# EAGLE design state_control (EAGLE 7.7.0)
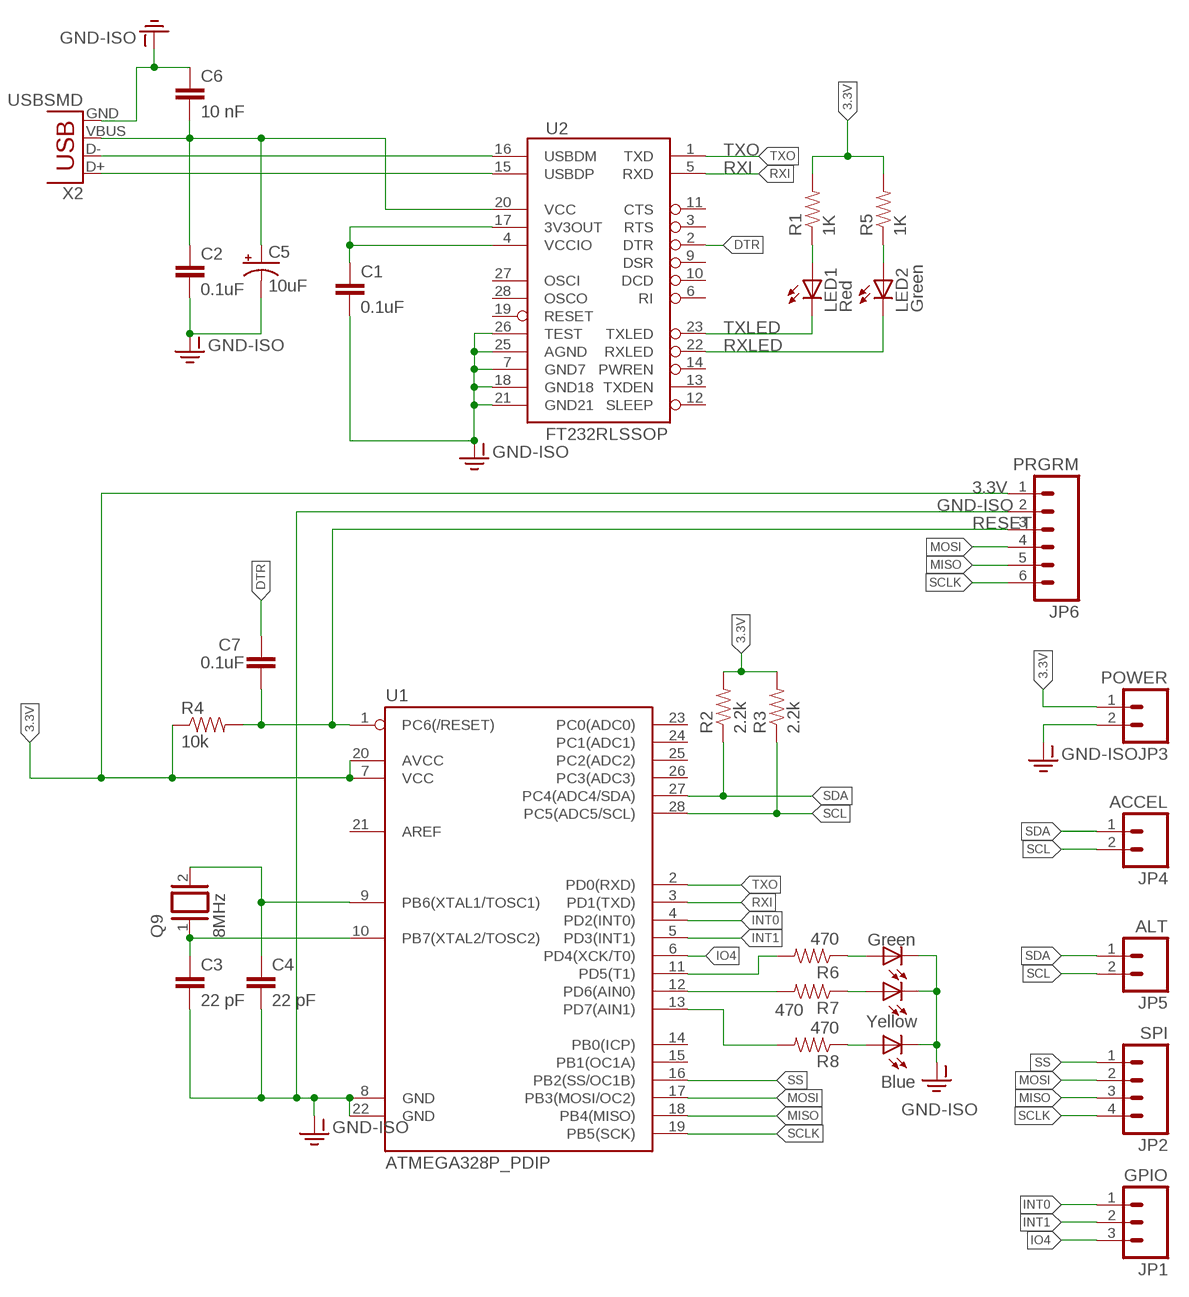
[diagram p0: schematic, sheet 1]

## Parts
C1  0.1uF  CAPPTH  [CAP-PTH-SMALL]
C2  0.1uF  CAPPTH  [CAP-PTH-SMALL]
C3  22 pF  CAPPTH  [CAP-PTH-SMALL]
C4  22 pF  CAPPTH  [CAP-PTH-SMALL]
C5  10uF  CAP_POLPTH2  [CPOL-RADIAL-10UF-25V]
C6  10 nF  CAPPTH  [CAP-PTH-SMALL]
C7  0.1uF  CAPPTH  [CAP-PTH-SMALL]
JP1  GPIO  M03PTH  [1X03]
JP2  SPI  M04PTH  [1X04]
JP3  POWER  M02PTH  [1X02]
JP4  ACCEL  M02PTH  [1X02]
JP5  ALT  M02PTH  [1X02]
JP6  PRGRM  M06SILK_FEMALE_PTH  [1X06]
LED1  Red  LED5MM  [LED5MM]
LED2  Green  LED5MM  [LED5MM]
LED3  Green  LED5MM  [LED5MM]
LED4  Yellow  LED5MM  [LED5MM]
LED5  Blue  LED5MM  [LED5MM]
Q9  8MHz  XTAL/S  [QS]
R1  1K  RESISTOR1206  [1206]
R2  2.2k  RESISTOR1206  [1206]
R3  2.2k  RESISTOR1206  [1206]
R4  10k  RESISTOR1206  [1206]
R5  1K  RESISTOR1206  [1206]
R6  470  RESISTOR1206  [1206]
R7  470  RESISTOR1206  [1206]
R8  470  RESISTOR1206  [1206]
U1  ATMEGA328P_PDIP  [DIL28-3]
U2  FT232RLSSOP  [SSOP28DB]
X2  USBSMD  [USB-MINIB]

## Nets
3.3V: JP3.1 JP6.1 R1.2 R2.2 R3.2 R4.1 R5.2 U1.7(VCC) U1.20(AVCC)
DTR: C7.1 U2.2(DTR)
GND-ISO: C1.2 C2.2 C3.2 C4.2 C5.2(-) C6.1 JP3.2 JP6.2 LED3.K(C) LED4.K(C) LED5.K(C) U1.8(GND) U1.22(GND) U2.7(GND7) U2.18(GND18) U2.21(GND21) U2.25(AGND) U2.26(TEST) X2.GND
INT0: JP1.1 U1.4(PD2(INT0))
INT1: JP1.2 U1.5(PD3(INT1))
IO4: JP1.3 U1.6(PD4(XCK/T0))
MISO: JP2.3 JP6.5 U1.18(PB4(MISO))
MOSI: JP2.2 JP6.4 U1.17(PB3(MOSI/OC2))
N$1: LED1.A R1.1
N$2: LED2.A R5.1
N$4: C1.1 U2.4(VCCIO) U2.17(3V3OUT)
N$5: R6.2 U1.11(PD5(T1))
N$6: R7.2 U1.12(PD6(AIN0))
N$7: R8.2 U1.13(PD7(AIN1))
N$8: LED3.A R6.1
N$9: LED4.A R7.1
N$10: LED5.A R8.1
N$11: C3.1 Q9.1 U1.10(PB7(XTAL2/TOSC2))
N$20: C4.1 Q9.2 U1.9(PB6(XTAL1/TOSC1))
RESET: C7.2 JP6.3 R4.2 U1.1(PC6(/RESET))
RXI: U1.3(PD1(TXD)) U2.5(RXD)
RXLED: LED2.K(C) U2.22(RXLED)
SCL: JP4.2 JP5.2 R3.1 U1.28(PC5(ADC5/SCL))
SCLK: JP2.4 JP6.6 U1.19(PB5(SCK))
SDA: JP4.1 JP5.1 R2.1 U1.27(PC4(ADC4/SDA))
SS: JP2.1 U1.16(PB2(SS/OC1B))
TXLED: LED1.K(C) U2.23(TXLED)
TXO: U1.2(PD0(RXD)) U2.1(TXD)
USB_D+: U2.15(USBDP) X2.D+
USB_D-: U2.16(USBDM) X2.D-
VBUS: C2.1 C5.1(+) C6.2 U2.20(VCC) X2.VBUS
Unconnected: U1.14(PB0(ICP)) U1.15(PB1(OC1A)) U1.21(AREF) U1.23(PC0(ADC0)) U1.24(PC1(ADC1)) U1.25(PC2(ADC2)) U1.26(PC3(ADC3)) U2.3(RTS) U2.6(RI) U2.9(DSR) U2.10(DCD) U2.11(CTS) U2.12(SLEEP) U2.13(TXDEN) U2.14(PWREN) U2.19(RESET) U2.27(OSCI) U2.28(OSCO)

## Library data of the parts
C1-C4 C6 C7 = SparkFun-Capacitors:CAP: Capacitor Standard 0603 ceramic capacitor, and 0.1" leaded capacitor.
C5 = SparkFun-Passives:CAP_POL: Capacitor Polarized These are standard SMD and PTH capacitors. Normally 10uF, 47uF, and 100uF in electrolytic and tantalum varieties. Always verify the external diameter of the through hole cap, it varies with capacity, voltage, and manufacturer. The EIA devices should be standard.
JP1 = SparkFun-Connectors:M03: Header 3 Standard 3-pin 0.1" header. Use with straight break away headers (SKU : PRT-00116), right angle break away headers (PRT-00553), swiss pins (PRT-00743), machine pins (PRT-00117), and female headers (PRT-00115). Molex polarized connector foot print use with SKU : PRT-08232 with associated crimp pins and housings.
JP2 = SparkFun-Connectors:M04: Header 4 Standard 4-pin 0.1" header. Use with straight break away headers (SKU : PRT-00116), right angle break away headers (PRT-00553), swiss pins (PRT-00743), machine pins (PRT-00117), and female headers (PRT-00115). Molex polarized connector foot print use with SKU : PRT-08231 with associated crimp pins and housings. 1MM SMD Version SKU: PRT-10208
JP3-JP5 = SparkFun-Connectors:M02: Standard 2-pin 0.1" header. Use with - straight break away headers ( PRT-00116) - right angle break away headers (PRT-00553) - swiss pins (PRT-00743) - machine pins (PRT-00117) - female headers (PRT-00115) Molex polarized connector foot print use with: PRT-08233 with associated crimp pins and housings. 2.54_SCREWTERM for use with PRT-10571. 3.5mm Screw Terminal footprints for PRT-08084 5mm Screw Terminal footprints for use with PRT-08432
JP6 = SparkFun-Connectors:M06: Header 6 Standard 6-pin 0.1" header. Use with straight break away headers (SKU : PRT-00116), right angle break away headers (PRT-00553), swiss pins (PRT-00743), machine pins (PRT-00117), and female headers (PRT-00115). Molex polarized connector foot print use with SKU : PRT-08094 with associated crimp pins and housings. NOTES ON THE VARIANTS LOCK and LOCK_LONGPADS... This footprint was designed to help hold the alignment of a through-hole component (i.e. 6-pin header) while soldering it into place. You may notice that each hole has been shifted either up or down by 0.005 of an inch from it's more standard position (which is a perfectly straight line). This slight alteration caused the pins (the squares in the middle) to touch the edges of the holes. Because they are alternating, it causes a "brace" to hold the component in place. 0.005 has proven to be the perfect amount of "off-center" position when using our standard breakaway headers. Although looks a little odd when you look at the bare footprint, once you have a header in there, the alteration is very hard to notice. Also,if you push a header all the way into place, it is covered up entirely on the bottom side. This idea of altering the position of holes to aid alignment will be further integrated into the Sparkfun Library for other footprints. It can help hold any component with 3 or more connection pins.; PROD_ID: CONN-08437
LED1-LED5 = adafruit:LED: LED OSRAM: - CHIPLED LG R971, LG N971, LY N971, LG Q971, LY Q971, LO R971, LY R971 LH N974, LH R974 LS Q976, LO Q976, LY Q976 LO Q996 - Hyper CHIPLED LW Q18S LB Q993, LB Q99A, LB R99A - SideLED LS A670, LO A670, LY A670, LG A670, LP A670 LB A673, LV A673, LT A673, LW A673 LH A674 LY A675 LS A676, LA A676, LO A676, LY A676, LW A676 LS A679, LY A679, LG A679 - Hyper Micro SIDELED® LS Y876, LA Y876, LO Y876, LY Y876 LT Y87S - SmartLED LW L88C, LW L88S LB L89C, LB L89S, LG L890 LS L89K, LO L89K, LY L89K LS L896, LA L896, LO L896, LY L896 - TOPLED LS T670, LO T670, LY T670, LG T670, LP T670 LSG T670, LSP T670, LSY T670, LOP T670, LYG T670 LG T671, LOG T671, LSG T671 LB T673, LV T673, LT T673, LW T673 LH T674 LS T676, LA T676, LO T676, LY T676, LB T676, LH T676, LSB T676, LW T676 LB T67C, LV T67C, LT T67C, LS T67K, LO T67K, LY T67K, LW E67C LS E67B, LA E67B, LO E67B, LY E67B, LB E67C, LV E67C, LT E67C LW T67C LS T679, LY T679, LG T679 LS T770, LO T770, LY T770, LG T770, LP T770 LB T773, LV T773, LT T773, LW T773 LH T774 LS E675, LA E675, LY E675, LS T675 LS T776, LA T776, LO T776, LY T776, LB T776 LHGB T686 LT T68C, LB T68C - Hyper Mini TOPLED® LB M676 - Mini TOPLED Santana® LG M470 LS M47K, LO M47K, LY M47K Source: http://www.osram.convergy.de/
Q9 = special:XTAL/S: CRYSTAL
R1 R5 = SparkFun-Resistors:RESISTOR: Resistor Basic schematic elements and footprints for 0603, 1206, and PTH resistors.
R2-R4 R6-R8 = SparkFun-Passives:RESISTOR: Resistor Basic schematic elements and footprints for 0603, 1206, and PTH resistors.
U1 = SparkFun-DigitalIC:ATMEGA328P_PDIP: uC used in the Arduino 32kb flash, 1k EEPROM, 2k SRAM This is the through-hole version of this chip.
U2 = SparkFun:FT232RL: USB UART FT232RL 4th Generation USB UART (USB <-> Serial) Controller. Spark Fun Electronics SKU : COM-00650
X2 = SparkFun-Connectors:USB: USB Connectors USB-B-PTH is fully proven SKU : PRT-00139/CONN-08278 USB-miniB is fully proven SKU : PRT-00587 USB-A-PCB is untested. USB-A-H is throughly reviewed, but untested. Spark Fun Electronics SKU : PRT-00437 USB-B-SMT is throughly reviewed, but untested. Needs silkscreen touching up. USB-A-S has not been used/tested USB-MB-H has not been used/tested USB-MICROB has been used. CONN-09505; PROD_ID: CONN-08193

## Net classes
1 actuator: width 0.813 mm, clearance 0.229 mm

## Board
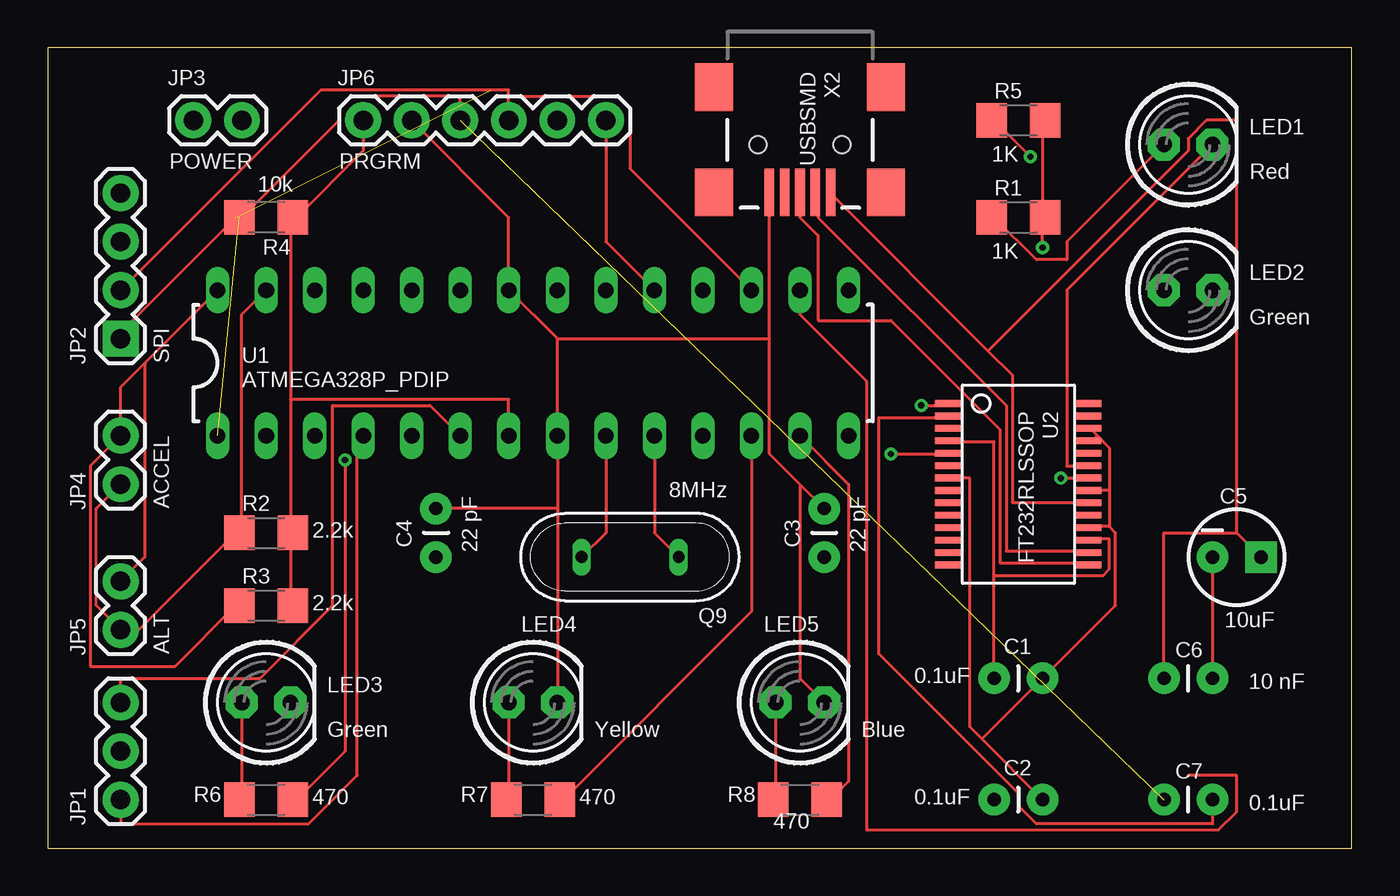
[diagram p1: board, top side]
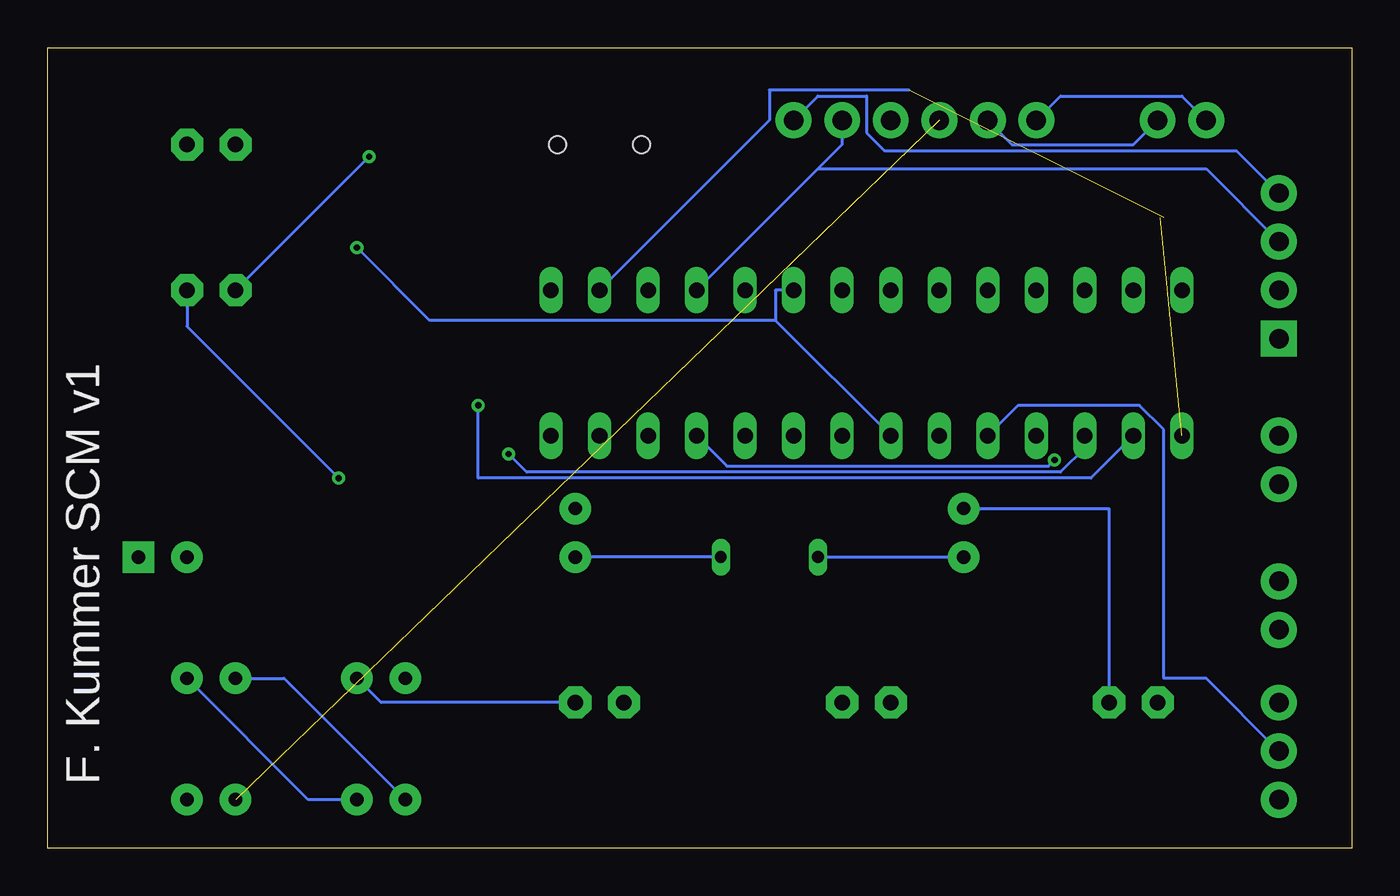
[diagram p2: board, bottom side, seen from below]

Size 68.25 x 41.9 mm. Coordinates in mm from the lower left corner, seen from the top.
Outline: 0,0 68.25,0 68.25,41.9 0,41.9 0,0
Copper layers (1*16): Top 0.0356mm / dielectric 1.5011mm / Bottom 0.0356mm
Design rules "LaenPCBOrder": minimum track width 6mil, minimum drill 13mil, track to track 6mil, track to pad 6mil, pad to pad 6mil, via to via 6mil, smd to smd 6mil, copper to edge 15mil, drill to drill 6mil, minimum pad ring 7mil, minimum via ring 7mil, stop-mask expansion 3mil, vias tented up to drill 0mil, thermal gap 10mil

### Footprints (pad centres in the part's own frame; a part is rotated, then mirrored left to right if it is on the bottom)
CAP-PTH-SMALL = drill 0.7 pad 1.651: 1 0,0; 2 2.54,0
CPOL-RADIAL-10UF-25V = drill 0.7 pad 1.651 square: 1 1.27,0 | drill 0.7 pad 1.651: 2 -1.27,0
1X03 = drill 1.016 pad 1.88: 1 0,0; 2 2.54,0; 3 5.08,0
1X04 = drill 1.016 pad 1.88 square: 1 0,0 | drill 1.016 pad 1.88: 2 2.54,0; 3 5.08,0; 4 7.62,0
1X02 = drill 1.016 pad 1.88: 1 0,0; 2 2.54,0
1X06 = drill 1.016 pad 1.88: 1 0,0; 2 2.54,0; 3 5.08,0; 4 7.62,0; 5 10.16,0; 6 12.7,0
LED5MM = drill 0.813 pad 1.676 octagon: A -1.27,0; K 1.27,0
QS = drill 0.61 long: 1 -2.54,0; 2 2.54,0
1206 = smd 1.6 x 1.8: 1 -1.4,0; 2 1.4,0
DIL28-3 = drill 0.813 long: 1 -16.51,-3.81; 2 -13.97,-3.81; 3 -11.43,-3.81; 4 -8.89,-3.81; 5 -6.35,-3.81; 6 -3.81,-3.81; 7 -1.27,-3.81; 8 1.27,-3.81; 9 3.81,-3.81; 10 6.35,-3.81; 11 8.89,-3.81; 12 11.43,-3.81; 13 13.97,-3.81; 14 16.51,-3.81; 15 16.51,3.81; 16 13.97,3.81; 17 11.43,3.81; 18 8.89,3.81; 19 6.35,3.81; 20 3.81,3.81; 21 1.27,3.81; 22 -1.27,3.81; 23 -3.81,3.81; 24 -6.35,3.81; 25 -8.89,3.81; 26 -11.43,3.81; 27 -13.97,3.81; 28 -16.51,3.81
SSOP28DB = smd 0.348 x 1.397: 1 -4.225,-3.656; 2 -3.575,-3.656; 3 -2.925,-3.656; 4 -2.275,-3.656; 5 -1.625,-3.656; 6 -0.975,-3.656; 7 -0.325,-3.656; 8 0.325,-3.656; 9 0.975,-3.656; 10 1.625,-3.656; 11 2.275,-3.656; 12 2.925,-3.656; 13 3.575,-3.656; 14 4.225,-3.656; 15 4.225,3.656; 16 3.575,3.656; 17 2.925,3.656; 18 2.275,3.656; 19 1.625,3.656; 20 0.975,3.656; 21 0.325,3.656; 22 -0.325,3.656; 23 -0.975,3.656; 24 -1.625,3.656; 25 -2.275,3.656; 26 -2.925,3.656; 27 -3.575,3.656; 28 -4.225,3.656
USB-MINIB = smd 2.5 x 0.5: D+ 2.5,0; D- 2.5,0.8; GND 2.5,-1.6; ID 2.5,-0.8; VBUS 2.5,1.6 | smd 2.5 x 2: MTN1 -3,4.5; MTN2 2.5,4.5; MTN3 -3,-4.5; MTN4 2.5,-4.5 | hole 0.9: 0,2.2; 0,-2.2

### Placement (x,y rotation side)
C1  49.53,8.89 0 top
C2  49.53,2.54 0 top
C3  40.64,15.24 90 top
C4  20.32,15.24 90 top
C5  62.23,15.24 0 top
C6  60.96,8.89 180 top
C7  60.96,2.54 180 top
JP1  3.81,2.54 90 top
JP2  3.81,26.67 90 top
JP3  7.62,38.1 0 top
JP4  3.81,19.05 90 top
JP5  3.81,11.43 90 top
JP6  16.51,38.1 0 top
LED1  59.69,36.83 0 top
LED2  59.69,29.21 0 top
LED3  11.43,7.62 0 top
LED4  25.4,7.62 0 top
LED5  39.37,7.62 0 top
Q9  30.48,15.24 180 top
R1  50.8,33.02 0 top
R2  11.43,16.51 0 top
R3  11.43,12.7 0 top
R4  11.43,33.02 180 top
R5  50.8,38.1 0 top
R6  11.43,2.54 0 top
R7  25.4,2.54 0 top
R8  39.37,2.54 0 top
U1  25.4,25.4 0 top
U2  50.8,19.05 270 top
X2  39.37,36.83 270 top

### Tracks (layer width: path | path; a pad name or v marks a point on that pad's centre or on a via)
3.3V  (via drill 0.33)
  Top 0.152: 12.7,16.51 12.7,12.7 R3.2 | JP6.1 16.51,36.51 13.02,33.02 R4.1 12.7,33.02 12.7,23.49 | 12.7,23.49 12.7,16.51 | 12.7,16.51 R2.2 | 52.07,33.02 52.07,38.1 R5.2 | v52.07,31.43 52.07,33.02 | 52.07,33.02 R1.2 | 12.7,23.49 24.13,23.49 U1.7
  Bottom 0.152: JP3.1 8.89,39.37 15.24,39.37 JP6.1 | 30.16,27.62 U1.7 | 30.16,27.62 30.16,29.21 U1.20 | v52.07,31.43 48.26,27.62 30.16,27.62
DTR
  Top 0.152: C7.1 60.96,1.27 51.75,1.27 50.8,2.22 50.8,2.86 43.5,10.16 43.5,22.54 46.99,22.54 U2.2
GND-ISO
  Top 0.152: 55.56,16.83 54.61,16.83 U2.18 | 55.56,18.73 55.56,20.95 54.93,21.59 | 55.56,18.73 55.56,16.83 | 54.93,21.59 54.61,21.91 U2.26 | 55.56,18.73 54.61,18.73 U2.21 | 54.93,21.59 54.61,21.27 U2.25 | 55.56,16.83 55.88,16.51 55.88,12.7 C1.2 48.9,5.71 | C5.2 C6.1 | C2.2 48.9,5.71 | 48.9,5.71 48.26,6.35 48.26,19.37 47.31,19.37 U2.7 | 37.78,26.67 37.78,20.64 39.37,19.05 | 37.78,26.67 37.78,34.29 X2.GND | C3.2 39.37,19.05 | LED5.K 39.37,8.89 39.37,19.05 | 26.67,26.67 U1.22 24.13,33.02 JP6.2 | 26.67,26.67 U1.8 26.67,17.78 | 26.67,17.78 C4.2 | 26.67,17.78 LED4.K | 26.67,26.67 37.78,26.67
  Bottom 0.152: C6.1 54.61,2.54 C2.2 | JP3.2 11.43,36.83 17.78,36.83 JP6.2 | LED3.K 12.7,17.78 C4.2 | C1.2 50.8,7.62 LED5.K
INT0
  Top 0.152: U1.4 16.19,21.27 16.19,3.81 13.65,1.27 3.81,1.27 JP1.1
INT1
  Bottom 0.152: U1.5 17.46,23.18 11.11,23.18 9.84,21.91 9.84,8.89 7.62,8.89 JP1.2
IO4
  Top 0.152: U1.6 20,23.18 14.92,23.18 14.92,12.7 11.11,8.89 3.81,8.89 JP1.3
MISO
  Bottom 0.152: 27.94,35.56 26.67,36.83 JP6.5 | 27.94,35.56 U1.18 | JP2.3 7.62,35.56 27.94,35.56
MOSI
  Top 0.152: U1.17 30.48,35.56 30.48,38.73 29.84,39.37 24.13,39.37 | JP6.4 24.13,39.37 | JP2.2 14.29,39.69 24.13,39.69 24.13,39.37
N$1
  Top 0.152: LED1.A 53.34,31.75 53.34,30.8 51.75,30.8 49.53,33.02 R1.1
N$2  (via drill 0.33)
  Top 0.152: v51.44,36.2 49.53,38.1 R5.1
  Bottom 0.152: LED2.A v51.44,36.2
N$4
  Top 0.152: C1.1 49.53,14.29 | 49.53,14.29 49.53,21.27 47.31,21.27 U2.4 | 49.53,14.29 55.24,14.29 55.56,14.6 55.56,16.19 54.61,16.19 U2.17
N$5  (via drill 0.33)
  Top 0.152: v15.56,20.32 15.56,5.08 13.02,2.54 R6.2
  Bottom 0.152: v15.56,20.32 15.88,20 32.7,20 U1.11
N$6
  Top 0.152: U1.12 36.83,12.38 26.99,2.54 R7.2
N$7
  Top 0.152: U1.13 41.91,19.05 41.91,3.49 40.96,2.54 R8.2
N$8
  Top 0.152: LED3.A 10.16,2.54 R6.1
N$9
  Top 0.152: LED4.A 24.13,2.54 R7.1
N$10
  Top 0.152: LED5.A 38.1,2.54 R8.1
N$11
  Top 0.152: Q9.1 31.75,16.51 U1.10
  Bottom 0.152: Q9.1 C3.1
N$20
  Top 0.152: Q9.2 29.21,16.51 U1.9
  Bottom 0.152: Q9.2 C4.1
RESET  (2 unrouted)
  Top 0.152: JP6.3 21.59,39.37 15.88,39.37 15.24,38.73 15.24,38.1 10.16,33.02 R4.2
RXI  (via drill 0.33)
  Top 0.152: v44.13,20.64 46.99,20.64 U2.5
  Bottom 0.152: v44.13,20.64 43.18,19.68 15.24,19.68 13.97,20.95 U1.3
RXLED  (via drill 0.33)
  Top 0.152: v53.02,19.37 54.29,19.37 U2.22
  Bottom 0.152: v53.02,19.37 60.96,27.3 LED2.K
SCL
  Top 0.152: R3.1 9.84,12.7 6.67,9.52 2.22,9.52 2.22,20 JP4.2 3.81,24.13 5.08,25.4 | 5.08,25.4 U1.28 | JP5.2 5.08,15.24 5.08,25.4
SCLK
  Top 0.152: U1.19 29.21,31.75 JP6.6
  Bottom 0.152: JP2.4 6.03,36.51 24.45,36.51 25.4,37.46 25.4,39.37 27.94,39.37 JP6.6
SDA
  Top 0.152: U1.27 10.16,27.94 10.16,16.51 R2.1 9.84,16.51 4.76,11.43 JP5.1 2.54,12.7 2.54,17.78 JP4.1
SS  (1 unrouted)
  Top 0.152: 9.84,33.02 3.81,26.99 JP2.1 | 59.69,3.81 62.23,3.81 62.23,1.91 61.28,0.95 42.86,0.95 42.86,24.45 39.37,27.94 U1.16
  Bottom 0.152: U1.16 30.48,38.1 30.48,39.69 23.18,39.69
TXLED
  Top 0.152: LED1.K 53.34,29.21 53.34,20 54.29,20 U2.23
TXO  (via drill 0.33)
  Top 0.152: v45.72,23.18 46.99,23.18 U2.1
  Bottom 0.152: v45.72,23.18 45.72,19.37 13.65,19.37 U1.2
USB_D+
  Top 0.152: X2.D+ 39.37,33.02 40.32,32.07 40.32,27.62 44.13,27.62 49.85,21.91 49.85,14.92 54.29,14.92 U2.15
USB_D-
  Top 0.152: U2.16 54.29,15.56 50.16,15.56 50.16,23.18 40.32,33.02 40.32,34.29 X2.D-
VBUS
  Top 0.152: 49.21,26.04 40.96,34.29 X2.VBUS | 49.21,26.04 50.48,24.77 50.48,18.1 54.29,18.1 U2.20 | 62.23,16.51 C5.1 | 62.23,16.51 58.42,16.51 C6.2 | 49.21,26.04 59.69,36.51 59.69,37.15 60.64,38.1 62.23,38.1 62.23,16.51
  Bottom 0.152: C2.1 55.88,8.89 C6.2

### Text on the board
bNames: F. Kummer SCM v1